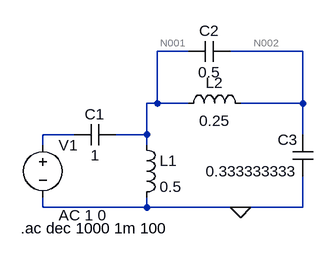
[diagram p0: schematic Draft1.asc]
Draft1.asc, the LTspice schematic file:
Version 4
SHEET 1 880 680
WIRE 224 -16 176 -16
WIRE 400 -16 288 -16
WIRE 176 64 176 -16
WIRE 176 64 160 64
WIRE 224 64 176 64
WIRE 400 64 400 -16
WIRE 400 64 304 64
WIRE 48 112 0 112
WIRE 160 112 160 64
WIRE 160 112 112 112
WIRE 400 112 400 64
WIRE 0 128 0 112
WIRE 160 128 160 112
WIRE 0 224 0 208
WIRE 160 224 160 208
WIRE 160 224 0 224
WIRE 304 224 160 224
WIRE 400 224 400 176
WIRE 400 224 304 224
FLAG 304 224 0
SYMBOL cap 112 96 R90
WINDOW 0 0 32 VBottom 2
WINDOW 3 32 32 VTop 2
SYMATTR InstName C1
SYMATTR Value 1
SYMBOL ind 144 112 R0
SYMATTR InstName L1
SYMATTR Value 0.5
SYMBOL ind 208 80 R270
WINDOW 0 32 56 VTop 2
WINDOW 3 5 56 VBottom 2
SYMATTR InstName L2
SYMATTR Value 0.25
SYMBOL cap 288 -32 R90
WINDOW 0 0 32 VBottom 2
WINDOW 3 32 32 VTop 2
SYMATTR InstName C2
SYMATTR Value 0.5
SYMBOL cap 416 176 R180
WINDOW 0 24 56 Left 2
WINDOW 3 24 8 Left 2
SYMATTR InstName C3
SYMATTR Value 0.333333333
SYMBOL voltage 0 112 R0
WINDOW 123 24 124 Left 2
WINDOW 39 0 0 Left 0
SYMATTR InstName V1
SYMATTR Value ""
SYMATTR Value2 AC 1 0
TEXT -34 256 Left 2 !.ac dec 1000 1m 100

The netlist it stands for:
* Draft1.asc
C1 N001 N003 1
L1 N001 0 0.5
L2 N001 N002 0.25
C2 N002 N001 0.5
C3 0 N002 0.333333333
V1 N003 0 AC 1 0
.ac dec 1000 1m 100
.backanno
.end

* Results of the author's LTspice run, read from the files saved beside the schematic
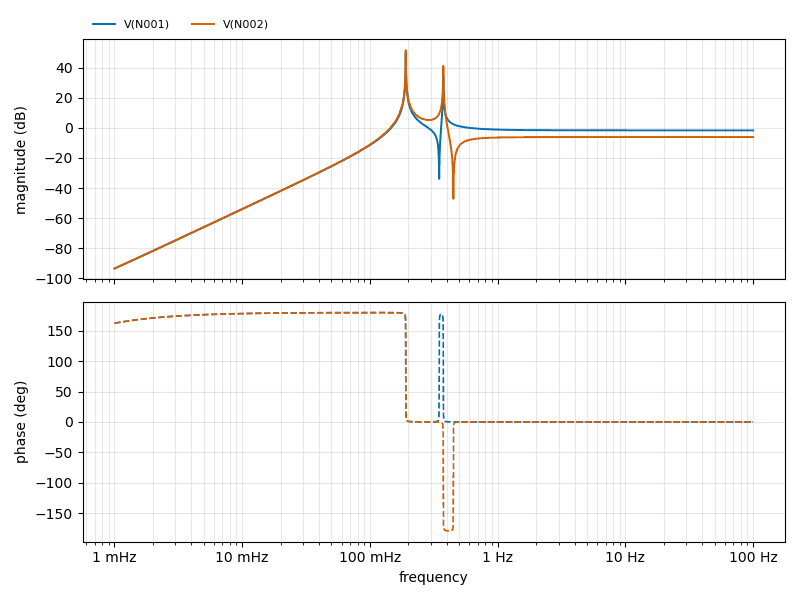
[diagram p1: AC Analysis of Draft1.asc, plotted from the saved traces]
* AC Analysis, 1 run:
*   V(N001): -93.67 dB at 1 mHz, -1.58 dB at 100 Hz, peak 50.37 dB at 191 mHz, 3 dB below the peak at 190.8 mHz and 191.1 mHz
*   V(N002): -93.67 dB at 1 mHz, -6.02 dB at 100 Hz, peak 51.74 dB at 191 mHz, 3 dB below the peak at 190.8 mHz and 191.1 mHz